# EAGLE design Schaltplan (EAGLE 7.4.0)
MAKER: Kevin Luedemann
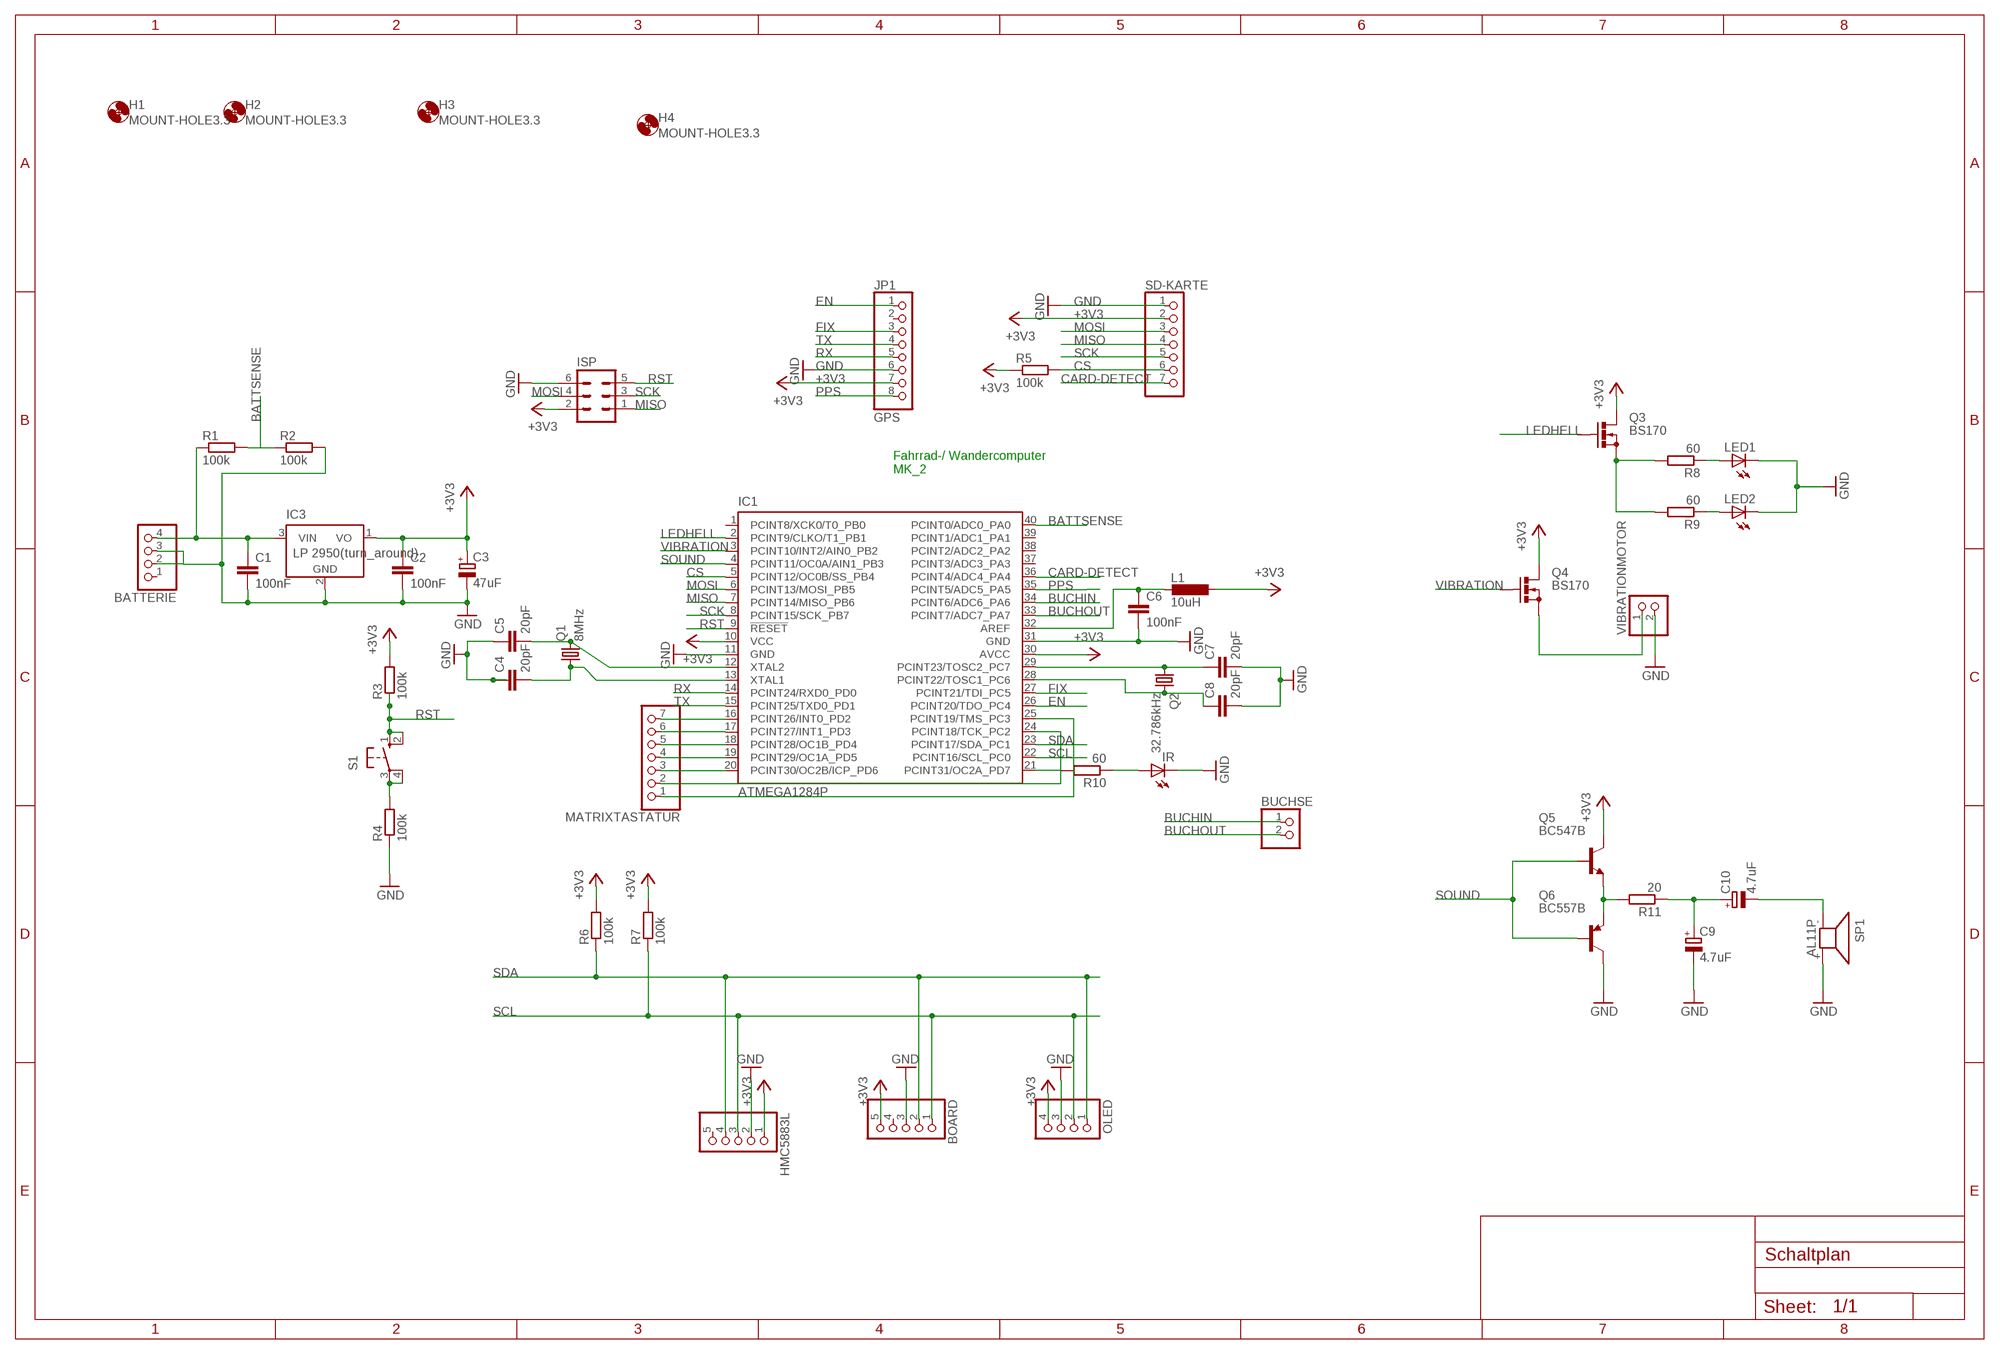
[diagram p0: schematic, sheet 1]

## Parts
BATTERIE  PINHD-1X4  [1X04]
BOARD  PINHD-1X5  [1X05]
BUCHSE  PINHD-1X2  [1X02]
C1  100nF  C-EU025-024X044  [C025-024X044]
C2  100nF  C-EU025-024X044  [C025-024X044]
C3  47uF  CPOL-EUE2.5-6  [E2,5-6]
C4  20pF  C-EU025-024X044  [C025-024X044]
C5  20pF  C-EU025-024X044  [C025-024X044]
C6  100nF  C-EU025-024X044  [C025-024X044]
C7  20pF  C-EU025-024X044  [C025-024X044]
C8  20pF  C-EU025-024X044  [C025-024X044]
C9  4.7uF  CPOL-EUE2.5-6  [E2,5-6]
C10  4.7uF  CPOL-EUE2.5-6  [E2,5-6]
H1  MOUNT-HOLE3.3  [3,3]
H2  MOUNT-HOLE3.3  [3,3]
H3  MOUNT-HOLE3.3  [3,3]
H4  MOUNT-HOLE3.3  [3,3]
HMC5883L  PINHD-1X5  [1X05]
IC1  ATMEGA1284P  ATMEGA644-20PU  [DIL40]
IC3  LP 2950(turn_around)  LM2936Z-3.0  [TO92]
IR  LED3MM  [LED3MM]
ISP  ML6  [ML6]
JP1  GPS  PINHD-1X8  [1X08]
L1  10uH  L-EU0207/10  [0207/10]
LED1  LED5MM  [LED5MM]
LED2  LED5MM  [LED5MM]
MATRIXTASTATUR  PINHD-1X7  [1X07]
OLED  PINHD-1X4  [1X04]
Q1  8MHz  CRYSTALHC49S  [HC49/S]
Q2  32.786kHz  CRYSTALTC26V  [TC26V]
Q3  BS170  [SOT54E]
Q4  BS170  [SOT54E]
Q5  BC547B  [TO92]
Q6  BC557B  [TO92-EBC]
R1  100k  R-EU_0207/10  [0207/10]
R2  100k  R-EU_0207/10  [0207/10]
R3  100k  R-EU_0207/10  [0207/10]
R4  100k  R-EU_0207/10  [0207/10]
R5  100k  R-EU_0207/10  [0207/10]
R6  100k  R-EU_0207/10  [0207/10]
R7  100k  R-EU_0207/10  [0207/10]
R8  60  R-EU_0207/10  [0207/10]
R9  60  R-EU_0207/10  [0207/10]
R10  60  R-EU_0207/10  [0207/10]
R11  20  R-EU_0207/10  [0207/10]
S1  10-XX  [B3F-10XX]
SD-KARTE  PINHD-1X7  [1X07]
SP1  AL11P  [AL11P]
VIBRATIONMOTOR  PINHD-1X2  [1X02]

## Nets
+3V3: BOARD.5 C2.1 C3.+ HMC5883L.1 IC1.10(VCC) IC1.30(AVCC) IC3.1(VO) ISP.2 JP1.7 L1.1 OLED.4 Q3.D Q4.D Q5.3(C) R3.2 R5.1 R6.2 R7.2 SD-KARTE.2
BATTSENSE: IC1.40(PCINT0/ADC0_PA0) R1.2 R2.1
BUCHIN: BUCHSE.1 IC1.34(PCINT6/ADC6_PA6)
BUCHOUT: BUCHSE.2 IC1.33(PCINT7/ADC7_PA7)
CARD-DETECT: IC1.36(PCINT4/ADC4_PA4) SD-KARTE.7
CS: IC1.5(PCINT12/OC0B/SS_PB4) R5.2 SD-KARTE.6
EN: IC1.26(PCINT20/TDO_PC4) JP1.1
FIX: IC1.27(PCINT21/TDI_PC5) JP1.3
GND: BATTERIE.2 BATTERIE.3 BOARD.3 C1.2 C2.2 C3.- C4.1 C5.1 C6.2 C7.2 C8.2 C9.- HMC5883L.2 IC1.11(GND) IC1.31(GND) IC3.2(GND) IR.K(C) ISP.6 JP1.6 LED1.K(C) LED2.K(C) OLED.3 Q6.C R2.2 R4.1 SD-KARTE.1 SP1.+ VIBRATIONMOTOR.2
LEDHELL: IC1.2(PCINT9/CLKO/T1_PB1) Q3.G
MISO: IC1.7(PCINT14/MISO_PB6) ISP.1 SD-KARTE.4
MOSI: IC1.6(PCINT13/MOSI_PB5) ISP.4 SD-KARTE.3
N$1: BATTERIE.4 C1.1 IC3.3(VIN) R1.1
N$2: C5.2 IC1.12(XTAL2) Q1.2
N$3: C7.1 IC1.29(PCINT23/TOSC2_PC7) Q2.1
N$4: C4.2 IC1.13(XTAL1) Q1.1
N$5: C8.1 IC1.28(PCINT22/TOSC1_PC6) Q2.2
N$6: R4.2 S1.3(P) S1.4(P1)
N$7: Q3.S R8.2 R9.2
N$8: C6.1 IC1.32(AREF) L1.2
N$9: LED1.A R8.1
N$10: LED2.A R9.1
N$11: IC1.16(PCINT26/INT0_PD2) MATRIXTASTATUR.7
N$12: IC1.17(PCINT27/INT1_PD3) MATRIXTASTATUR.6
N$13: IC1.18(PCINT28/OC1B_PD4) MATRIXTASTATUR.5
N$14: Q4.S VIBRATIONMOTOR.1
N$15: IC1.19(PCINT29/OC1A_PD5) MATRIXTASTATUR.4
N$16: IC1.20(PCINT30/OC2B/ICP_PD6) MATRIXTASTATUR.3
N$17: IC1.24(PCINT18/TCK_PC2) MATRIXTASTATUR.2
N$18: IC1.25(PCINT19/TMS_PC3) MATRIXTASTATUR.1
N$19: IC1.21(PCINT31/OC2A_PD7) R10.2
N$20: IR.A R10.1
N$21: Q5.1(E) Q6.E R11.2
N$22: C9.+ C10.+ R11.1
N$23: C10.- SP1.-
PPS: IC1.35(PCINT5/ADC5_PA5) JP1.8
RST: IC1.9(!RESET) ISP.5 R3.1 S1.1(S) S1.2(S1)
RX: IC1.14(PCINT24/RXD0_PD0) JP1.5
SCK: IC1.8(PCINT15/SCK_PB7) ISP.3 SD-KARTE.5
SCL: BOARD.1 HMC5883L.3 IC1.22(PCINT16/SCL_PC0) OLED.2 R7.1
SDA: BOARD.2 HMC5883L.4 IC1.23(PCINT17/SDA_PC1) OLED.1 R6.1
SOUND: IC1.4(PCINT11/OC0A/AIN1_PB3) Q5.2(B) Q6.B
TX: IC1.15(PCINT25/TXD0_PD1) JP1.4
VIBRATION: IC1.3(PCINT10/INT2/AIN0_PB2) Q4.G
Unconnected: BATTERIE.1 BOARD.4 HMC5883L.5 IC1.1(PCINT8/XCK0/T0_PB0) IC1.37(PCINT3/ADC3_PA3) IC1.38(PCINT2/ADC2_PA2) IC1.39(PCINT1/ADC1_PA1) JP1.2

## Notes on the sheet
- Fahrrad-/ Wandercomputer
  MK_2

## Library data of the parts
BATTERIE OLED = pinhead:PINHD-1X4: PIN HEADER
BOARD HMC5883L = pinhead:PINHD-1X5: PIN HEADER
BUCHSE VIBRATIONMOTOR = pinhead:PINHD-1X2: PIN HEADER
C1 C2 C4-C8 = rcl:C-EU: CAPACITOR, European symbol
C3 C9 C10 = rcl:CPOL-EU: POLARIZED CAPACITOR, European symbol
H1-H4 = holes:MOUNT-HOLE: MOUNTING HOLE with drill center marker
IC1 = atmel:ATMEGA644-*PU: 8-bit Microcontroller with 64K Bytes In-System Programmable Flash Auto generated by make-symbol-device-package-bsdl.ulp Rev. 34 Source: http://www.atmel.com/dyn/resources/prod_documents/doc2593.pdf; MPN: ATMEGA644-20PU; OC_FARNELL: 1288340; OC_NEWARK: 23M5060
IC3 = national-semiconductor:LM2936?*: Ultra-Low Quiescent Current LDO Voltage Regulator Source: Data sheet <http://www.national.com/ds/LM/LM2936.pdf>; MF: NATIONAL SEMICONDUCTOR; MPN: LM2936Z-3.0/NOPB; OC_FARNELL: 1312709; OC_NEWARK: 41K4531
IR LED1 LED2 = led:LED: LED OSRAM: - CHIPLED LG R971, LG N971, LY N971, LG Q971, LY Q971, LO R971, LY R971 LH N974, LH R974 LS Q976, LO Q976, LY Q976 LO Q996 - Hyper CHIPLED LW Q18S LB Q993, LB Q99A, LB R99A - SideLED LS A670, LO A670, LY A670, LG A670, LP A670 LB A673, LV A673, LT A673, LW A673 LH A674 LY A675 LS A676, LA A676, LO A676, LY A676, LW A676 LS A679, LY A679, LG A679 - Hyper Micro SIDELED® LS Y876, LA Y876, LO Y876, LY Y876 LT Y87S - SmartLED LW L88C, LW L88S LB L89C, LB L89S, LG L890 LS L89K, LO L89K, LY L89K LS L896, LA L896, LO L896, LY L896 - TOPLED LS T670, LO T670, LY T670, LG T670, LP T670 LSG T670, LSP T670, LSY T670, LOP T670, LYG T670 LG T671, LOG T671, LSG T671 LB T673, LV T673, LT T673, LW T673 LH T674 LS T676, LA T676, LO T676, LY T676, LB T676, LH T676, LSB T676, LW T676 LB T67C, LV T67C, LT T67C, LS T67K, LO T67K, LY T67K, LW E67C LS E67B, LA E67B, LO E67B, LY E67B, LB E67C, LV E67C, LT E67C LW T67C LS T679, LY T679, LG T679 LS T770, LO T770, LY T770, LG T770, LP T770 LB T773, LV T773, LT T773, LW T773 LH T774 LS E675, LA E675, LY E675, LS T675 LS T776, LA T776, LO T776, LY T776, LB T776 LHGB T686 LT T68C, LB T68C - Hyper Mini TOPLED® LB M676 - Mini TOPLED Santana® LG M470 LS M47K, LO M47K, LY M47K Source: http://www.osram.convergy.de LUXEON: - LUMILED® LXK2-PW12-R00, LXK2-PW12-S00, LXK2-PW14-U00, LXK2-PW14-V00 LXK2-PM12-R00, LXK2-PM12-S00, LXK2-PM14-U00 LXK2-PE12-Q00, LXK2-PE12-R00, LXK2-PE12-S00, LXK2-PE14-T00, LXK2-PE14-U00 LXK2-PB12-K00, LXK2-PB12-L00, LXK2-PB12-M00, LXK2-PB14-N00, LXK2-PB14-P00, LXK2-PB14-Q00 LXK2-PR12-L00, LXK2-PR12-M00, LXK2-PR14-Q00, LXK2-PR14-R00 LXK2-PD12-Q00, LXK2-PD12-R00, LXK2-PD12-S00 LXK2-PH12-R00, LXK2-PH12-S00 LXK2-PL12-P00, LXK2-PL12-Q00, LXK2-PL12-R00 Source: www.luxeon.com KINGBRIGHT: KA-3528ASYC Source: www.kingbright.com
ISP = con-ml:ML6: HARTING; OC_FARNELL: unknown; OC_NEWARK: unknown
JP1 = pinhead:PINHD-1X8: PIN HEADER
L1 = rcl:L-EU: INDUCTOR, European symbol
MATRIXTASTATUR SD-KARTE = pinhead:PINHD-1X7: PIN HEADER
Q1 = crystal:CRYSTAL: CRYSTAL; OC_FARNELL: 1667008; OC_NEWARK: unknown
Q2 = crystal:CRYSTAL: CRYSTAL; OC_FARNELL: unknown; OC_NEWARK: unknown
Q3 Q4 = transistor-small-signal:BS170: N-CHANNEL MOS FET
Q5 = transistor-npn:BC547*: NPN Transistor
Q6 = transistor-pnp:BC557*: PNP Transistror
R1-R11 = rcl:R-EU_: RESISTOR, European symbol
S1 = switch-omron:10-XX: OMRON SWITCH; MPN: B3F-1000; OC_FARNELL: 176432; OC_NEWARK: 36M3542
SP1 = buzzer:AL11P: SPEAKER Source: Buerklin; OC_FARNELL: unknown; OC_NEWARK: unknown

## Board
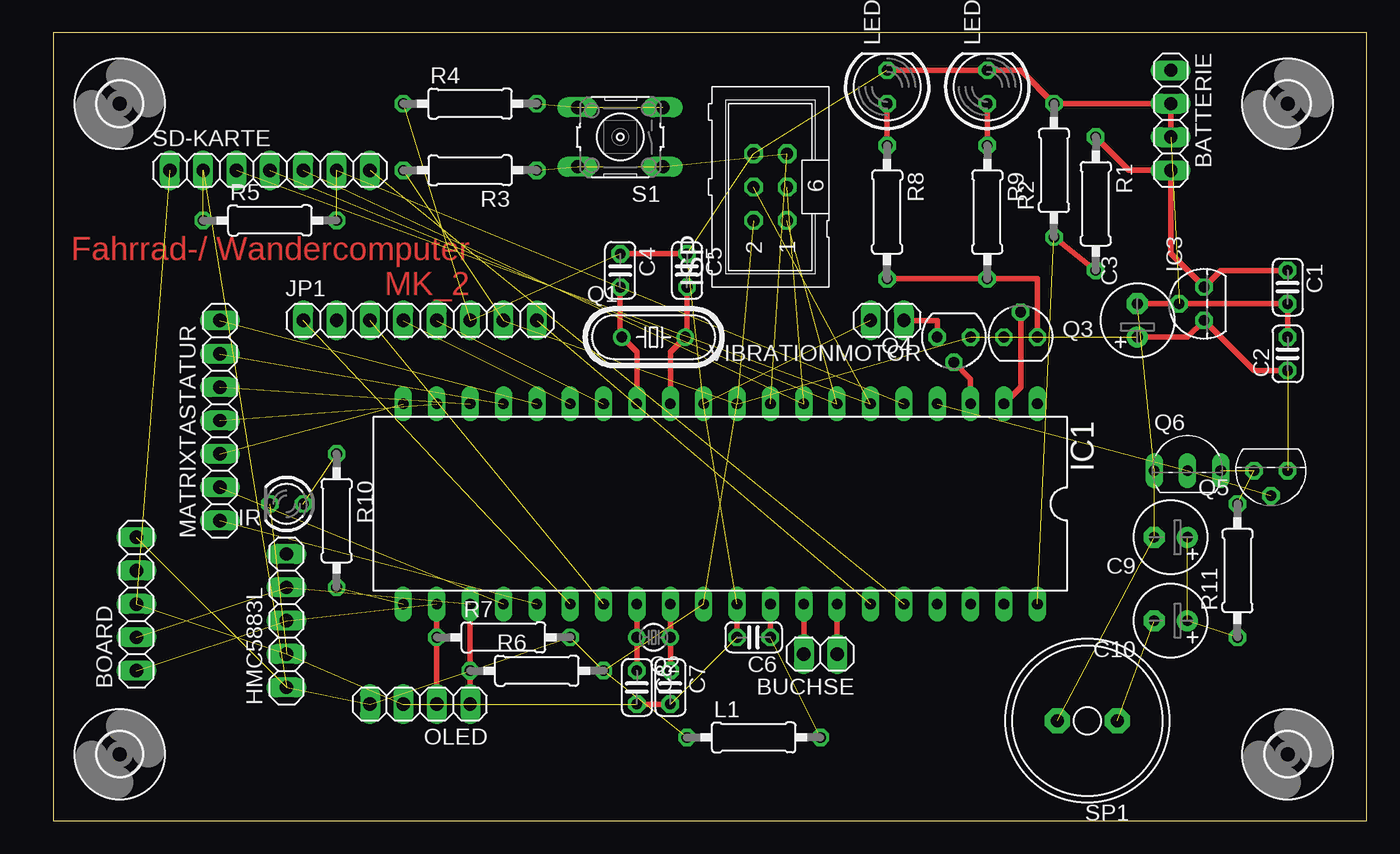
[diagram p1: board, top side]

Size 100 x 60 mm. Coordinates in mm from the lower left corner, seen from the top.
Outline: 0,0 100,0 100,60 0,60 0,0
Copper layers (1*16): Top 0.035mm / dielectric 1.5mm / Bottom 0.035mm
Design rules "default": minimum track width 10mil, minimum drill 24mil, track to track 8mil, track to pad 8mil, pad to pad 8mil, via to via 8mil, smd to smd 8mil, copper to edge 40mil, drill to drill 8mil, minimum pad ring 10mil, minimum via ring 8mil, stop-mask expansion 4mil, vias tented up to drill 0mil, thermal gap 10mil

### Footprints (pad centres in the part's own frame; a part is rotated, then mirrored left to right if it is on the bottom)
1X04 = drill 1.016 long: 1 -3.81,0; 2 -1.27,0; 3 1.27,0; 4 3.81,0
1X05 = drill 1.016 long: 1 -5.08,0; 2 -2.54,0; 3 0,0; 4 2.54,0; 5 5.08,0
1X02 = drill 1.016 long: 1 -1.27,0; 2 1.27,0
C025-024X044 = drill 0.813 octagon: 1 -1.27,0; 2 1.27,0
E2,5-6 = drill 0.813 pad 1.6: + -1.27,0 | drill 0.813 pad 1.6 octagon: - 1.27,0
3,3 = hole 3.3: 0,0
DIL40 = drill 0.813 long: 1 -24.13,-7.62; 2 -21.59,-7.62; 3 -19.05,-7.62; 4 -16.51,-7.62; 5 -13.97,-7.62; 6 -11.43,-7.62; 7 -8.89,-7.62; 8 -6.35,-7.62; 9 -3.81,-7.62; 10 -1.27,-7.62; 11 1.27,-7.62; 12 3.81,-7.62; 13 6.35,-7.62; 14 8.89,-7.62; 15 11.43,-7.62; 16 13.97,-7.62; 17 16.51,-7.62; 18 19.05,-7.62; 19 21.59,-7.62; 20 24.13,-7.62; 21 24.13,7.62; 22 21.59,7.62; 23 19.05,7.62; 24 16.51,7.62; 25 13.97,7.62; 26 11.43,7.62; 27 8.89,7.62; 28 6.35,7.62; 29 3.81,7.62; 30 1.27,7.62; 31 -1.27,7.62; 32 -3.81,7.62; 33 -6.35,7.62; 34 -8.89,7.62; 35 -11.43,7.62; 36 -13.97,7.62; 37 -16.51,7.62; 38 -19.05,7.62; 39 -21.59,7.62; 40 -24.13,7.62
TO92 = drill 0.813 pad 1.27 octagon: 1 -1.27,0; 2 0,1.905; 3 1.27,0
LED3MM = drill 0.813 octagon: A -1.27,0; K 1.27,0
ML6 = drill 0.914 octagon: 1 -2.54,-1.27; 2 -2.54,1.27; 3 0,-1.27; 4 0,1.27; 5 2.54,-1.27; 6 2.54,1.27
1X08 = drill 1.016 long: 1 -8.89,0; 2 -6.35,0; 3 -3.81,0; 4 -1.27,0; 5 1.27,0; 6 3.81,0; 7 6.35,0; 8 8.89,0
0207/10 = drill 0.813 octagon: 1 -5.08,0; 2 5.08,0
LED5MM = drill 0.813 octagon: A -1.27,0; K 1.27,0
1X07 = drill 1.016 long: 1 -7.62,0; 2 -5.08,0; 3 -2.54,0; 4 0,0; 5 2.54,0; 6 5.08,0; 7 7.62,0
HC49/S = drill 0.813: 1 -2.413,0; 2 2.413,0
TC26V = drill 0.813: 1 -1.27,0; 2 1.27,0
SOT54E = drill 0.813 octagon: D -1.27,0; G 0,1.905; S 1.27,0
TO92' = drill 0.813 octagon: 1 1.27,0; 2 0,1.905; 3 -1.27,0
TO92-EBC = drill 0.813 long: B 0,-1.27; C -2.54,-1.27; E 2.54,-1.27
B3F-10XX = drill 1.016 long: 1 -3.251,2.261; 2 3.251,2.261; 3 -3.251,-2.261; 4 3.251,-2.261
AL11P = drill 1.016 pad 1.905 octagon: + 2.286,0; - -2.286,0

### Placement (x,y rotation side)
BATTERIE  85.09,53.34 270 top
BOARD  6.35,16.51 90 top
BUCHSE  58.42,12.7 180 top
C1  93.98,40.64 270 top
C2  93.98,35.56 90 top
C3  82.55,38.1 90 top
C4  43.18,41.91 270 top
C5  48.26,41.91 270 top
C6  53.34,13.97 180 top
C7  46.99,10.16 270 top
C8  44.45,10.16 270 top
C9  85.09,21.59 180 top
C10  85.09,15.24 180 top
H1  5.08,5.08 0 top
H2  93.98,5.08 0 top
H3  5.08,54.61 0 top
H4  93.98,54.61 0 top
HMC5883L  17.78,15.24 90 top
IC1  50.8,24.13 180 top
IC3  87.63,39.37 90 top
IR  17.78,24.13 180 top
ISP  54.61,48.26 90 top
JP1  27.94,38.1 0 top
L1  53.34,6.35 0 top
LED1  63.5,55.88 90 top
LED2  71.12,55.88 90 top
MATRIXTASTATUR  12.7,30.48 90 top
OLED  27.94,8.89 180 top
Q1  45.72,36.83 0 top
Q2  45.72,13.97 180 top
Q3  73.66,36.83 0 top
Q4  68.58,36.83 180 top
Q5  BC547B  [TO92']  92.71,26.67 180 top
Q6  86.36,27.94 0 top
R1  79.38,46.99 270 top
R2  76.2,49.53 90 top
R3  31.75,49.53 180 top
R4  31.75,54.61 0 top
R5  16.51,45.72 0 top
R6  36.83,11.43 0 top
R7  34.29,13.97 0 top
R8  63.5,46.35 270 top
R9  71.12,46.35 270 top
R10  21.59,22.86 270 top
R11  90.17,19.05 90 top
S1  43.18,52.07 180 top
SD-KARTE  16.51,49.53 0 top
SP1  78.74,7.62 180 top
VIBRATIONMOTOR  63.5,38.1 180 top

### Tracks (layer width: path | path; a pad name or v marks a point on that pad's centre or on a via)
+3V3  (16 unrouted)
  Top 0.406: C2.1 91.44,34.29 IC3.1 86.36,36.83 C3.+
BATTSENSE  (1 unrouted)
  Top 0.406: R2.1 R1.2
BUCHIN
  Top 0.406: IC1.34 BUCHSE.1
BUCHOUT
  Top 0.406: IC1.33 BUCHSE.2
CARD-DETECT  (1 unrouted)
CS  (2 unrouted)
EN  (1 unrouted)
FIX  (1 unrouted)
GND  (17 unrouted)
  Top 0.254: 52.12,16.46 IC1.31
  Top 0.406: C7.2 C8.2 | 52.12,16.46 52.07,16.46 C6.2 | C4.1 C5.1 | BATTERIE.3 BATTERIE.2 R2.2 73.66,57.15 LED2.K LED1.K | C2.2 C1.2 IC3.2 C3.-
LEDHELL
  Top 0.406: Q3.G 73.66,33.02 IC1.2
MISO  (2 unrouted)
MOSI  (2 unrouted)
N$1
  Top 0.406: R1.1 81.92,49.53 BATTERIE.4 85.09,43.18 IC3.3 88.9,41.91 C1.1
N$2
  Top 0.406: IC1.12 46.99,35.69 Q1.2 48.26,36.96 C5.2
N$3
  Top 0.406: IC1.29 Q2.1 C7.1
N$4
  Top 0.406: IC1.13 44.45,35.69 Q1.1 43.18,36.96 C4.2
N$5
  Top 0.406: IC1.28 Q2.2 C8.1
N$6  (2 unrouted)
N$7
  Top 0.406: R8.2 R9.2 74.93,41.27 Q3.S
N$8  (1 unrouted)
  Top 0.406: IC1.32 C6.1
N$9
  Top 0.406: LED1.A R8.1
N$10
  Top 0.406: LED2.A R9.1
N$11  (1 unrouted)
N$12  (1 unrouted)
N$13  (1 unrouted)
N$14
  Top 0.406: Q4.S 67.31,38.1 VIBRATIONMOTOR.1
N$15  (1 unrouted)
N$16  (1 unrouted)
N$17  (1 unrouted)
N$18  (1 unrouted)
N$19  (1 unrouted)
N$20  (1 unrouted)
N$21  (2 unrouted)
N$22  (2 unrouted)
N$23  (1 unrouted)
PPS  (1 unrouted)
RST  (4 unrouted)
RX  (1 unrouted)
SCK  (2 unrouted)
SCL  (2 unrouted)
  Top 0.406: IC1.22 R7.1 OLED.2
SDA  (2 unrouted)
  Top 0.406: IC1.23 R6.1 OLED.1
SOUND  (2 unrouted)
TX  (1 unrouted)
VIBRATION
  Top 0.406: Q4.G 69.85,33.66 IC1.3

### Text on the board
Top: Fahrrad-/ Wandercomputer / MK_2